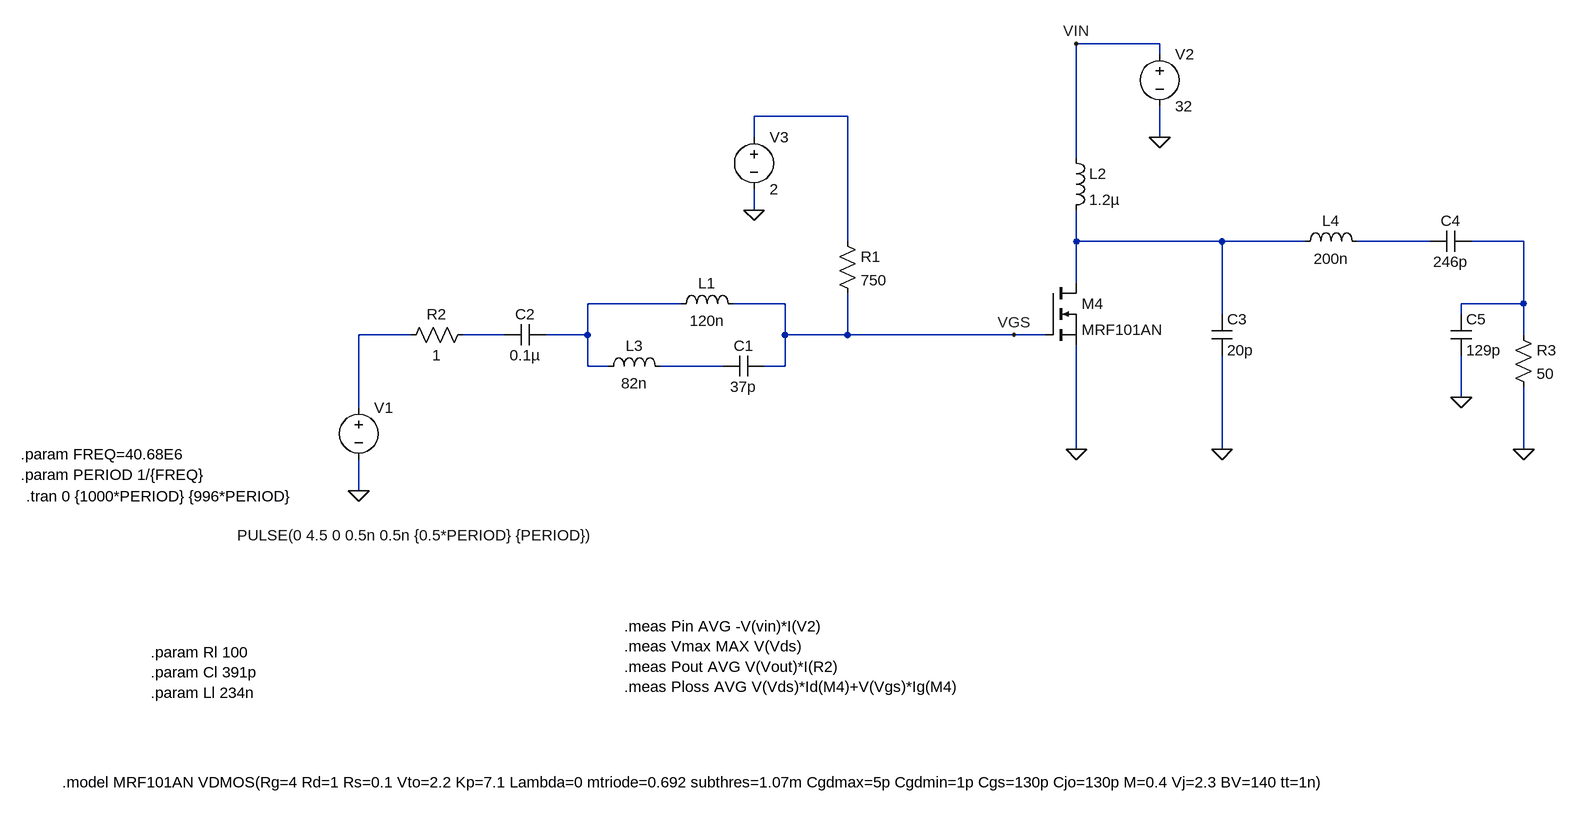
[diagram p0: schematic class_E_final.asc]
class_E_final.asc, the LTspice schematic file:
Version 4
SHEET 1 3300 912
WIRE 416 -240 288 -240
WIRE 416 -224 416 -240
WIRE -64 -128 -208 -128
WIRE -208 -96 -208 -128
WIRE 416 -96 416 -144
WIRE 288 -64 288 -240
WIRE -208 16 -208 -16
WIRE -64 64 -64 -128
WIRE 288 64 288 16
WIRE 512 64 288 64
WIRE 640 64 512 64
WIRE 832 64 720 64
WIRE 976 64 896 64
WIRE 288 128 288 64
WIRE -320 160 -464 160
WIRE -160 160 -240 160
WIRE 976 160 976 64
WIRE 976 160 880 160
WIRE 512 176 512 64
WIRE 880 176 880 160
WIRE -736 208 -816 208
WIRE -592 208 -656 208
WIRE -464 208 -464 160
WIRE -464 208 -528 208
WIRE -160 208 -160 160
WIRE -64 208 -64 144
WIRE -64 208 -160 208
WIRE 192 208 -64 208
WIRE 240 208 192 208
WIRE 976 208 976 160
WIRE -464 256 -464 208
WIRE -432 256 -464 256
WIRE -256 256 -352 256
WIRE -160 256 -160 208
WIRE -160 256 -192 256
WIRE 880 304 880 240
WIRE -816 320 -816 208
WIRE 288 384 288 224
WIRE 512 384 512 240
WIRE 976 384 976 288
WIRE -816 448 -816 400
FLAG 288 384 0
FLAG 416 -96 0
FLAG -816 448 0
FLAG -208 16 0
FLAG 288 -240 VIN
FLAG 192 208 VGS
FLAG 512 384 0
FLAG 976 384 0
FLAG 880 304 0
SYMBOL res -80 48 R0
SYMATTR InstName R1
SYMATTR Value 750
SYMBOL ind 272 -80 R0
SYMATTR InstName L2
SYMATTR Value 1.2µ
SYMBOL voltage -816 304 R0
WINDOW 123 0 0 Left 0
WINDOW 39 0 0 Left 0
WINDOW 3 -187 212 Left 2
SYMATTR Value PULSE(0 4.5 0 0.5n 0.5n {0.5*PERIOD} {PERIOD})
SYMATTR InstName V1
SYMBOL voltage 416 -240 R0
WINDOW 123 0 0 Left 0
WINDOW 39 0 0 Left 0
SYMATTR InstName V2
SYMATTR Value 32
SYMBOL voltage -208 -112 R0
WINDOW 123 0 0 Left 0
WINDOW 39 0 0 Left 0
SYMATTR InstName V3
SYMATTR Value 2
SYMBOL nmos 240 128 R0
SYMATTR InstName M4
SYMATTR Value MRF101AN
SYMBOL cap 496 176 R0
SYMATTR InstName C3
SYMATTR Value 20p
SYMBOL ind -336 176 R270
WINDOW 0 32 56 VTop 2
WINDOW 3 5 56 VBottom 2
SYMATTR InstName L1
SYMATTR Value 120n
SYMATTR SpiceLine Rser=0.5
SYMBOL ind -448 272 R270
WINDOW 0 32 56 VTop 2
WINDOW 3 5 56 VBottom 2
SYMATTR InstName L3
SYMATTR Value 82n
SYMATTR SpiceLine Rser=0.5
SYMBOL cap -192 240 R90
WINDOW 0 0 32 VBottom 2
WINDOW 3 32 32 VTop 2
SYMATTR InstName C1
SYMATTR Value 37p
SYMBOL cap -528 192 R90
WINDOW 0 0 32 VBottom 2
WINDOW 3 32 32 VTop 2
SYMATTR InstName C2
SYMATTR Value 0.1µ
SYMBOL res -640 192 R90
WINDOW 0 0 56 VBottom 2
WINDOW 3 32 56 VTop 2
SYMATTR InstName R2
SYMATTR Value 1
SYMBOL ind 624 80 R270
WINDOW 0 32 56 VTop 2
WINDOW 3 5 56 VBottom 2
SYMATTR InstName L4
SYMATTR Value 200n
SYMBOL cap 896 48 R90
WINDOW 0 0 32 VBottom 2
WINDOW 3 32 32 VTop 2
SYMATTR InstName C4
SYMATTR Value 246p
SYMBOL res 960 192 R0
SYMATTR InstName R3
SYMATTR Value 50
SYMBOL cap 864 176 R0
SYMATTR InstName C5
SYMATTR Value 129p
TEXT -1336 392 Left 2 !.param FREQ=40.68E6\n.param PERIOD 1/{FREQ}
TEXT -1328 456 Left 2 !.tran 0 {1000*PERIOD} {996*PERIOD}
TEXT -1272 896 Left 2 !.model MRF101AN VDMOS(Rg=4 Rd=1 Rs=0.1 Vto=2.2 Kp=7.1 Lambda=0 mtriode=0.692 subthres=1.07m Cgdmax=5p Cgdmin=1p Cgs=130p Cjo=130p M=0.4 Vj=2.3 BV=140 tt=1n)
TEXT -408 656 Left 2 !.meas Pin AVG -V(vin)*I(V2)\n.meas Vmax MAX V(Vds)\n.meas Pout AVG V(Vout)*I(R2)\n.meas Ploss AVG V(Vds)*Id(M4)+V(Vgs)*Ig(M4)
TEXT -1136 696 Left 2 !.param Rl 100\n.param Cl 391p\n.param Ll 234n

The netlist it stands for:
* class_E_final.asc
R1 N001 VGS 750
L2 VIN N002 1.2µ
V1 N006 0 PULSE(0 4.5 0 0.5n 0.5n {0.5*PERIOD} {PERIOD})
V2 VIN 0 32
V3 N001 0 2
M4 N002 VGS 0 0 MRF101AN
C3 N002 0 20p
L1 N005 VGS 120n Rser=0.5
L3 N005 N008 82n Rser=0.5
C1 VGS N008 37p
C2 N005 N007 0.1µ
R2 N007 N006 1
L4 N002 N003 200n
C4 N004 N003 246p
R3 N004 0 50
C5 N004 0 129p
.model NMOS NMOS
.model PMOS PMOS
.lib standard.mos
.param FREQ=40.68E6
.param PERIOD 1/{FREQ}
.tran 0 {1000*PERIOD} {996*PERIOD}
.model MRF101AN VDMOS(Rg=4 Rd=1 Rs=0.1 Vto=2.2 Kp=7.1 Lambda=0 mtriode=0.692 subthres=1.07m Cgdmax=5p Cgdmin=1p Cgs=130p Cjo=130p M=0.4 Vj=2.3 BV=140 tt=1n)
.meas Pin AVG -V(vin)*I(V2)
.meas Vmax MAX V(Vds)
.meas Pout AVG V(Vout)*I(R2)
.meas Ploss AVG V(Vds)*Id(M4)+V(Vgs)*Ig(M4)
.param Rl 100
.param Cl 391p
.param Ll 234n
.backanno
.end